# Altium schematic sheet VREF.SchDoc
size A4; ApprovedBy: Mateusz Kowalik; CheckedBy: Mateusz Kowalik; Author: Mateusz Kowalik; CompanyName: InMotion Labs sp. z o.o.; DrawnBy: Mateusz Kowalik; Engineer: Mateusz Kowalik; Organization: InMotion Labs sp. z o.o.; Address1: Rydlówka 5A; Address2: 30-363 Kraków; Address4: Poland; DocumentNumber: 11; Revision: Rev 0; SheetNumber: 11; SheetTotal: 17
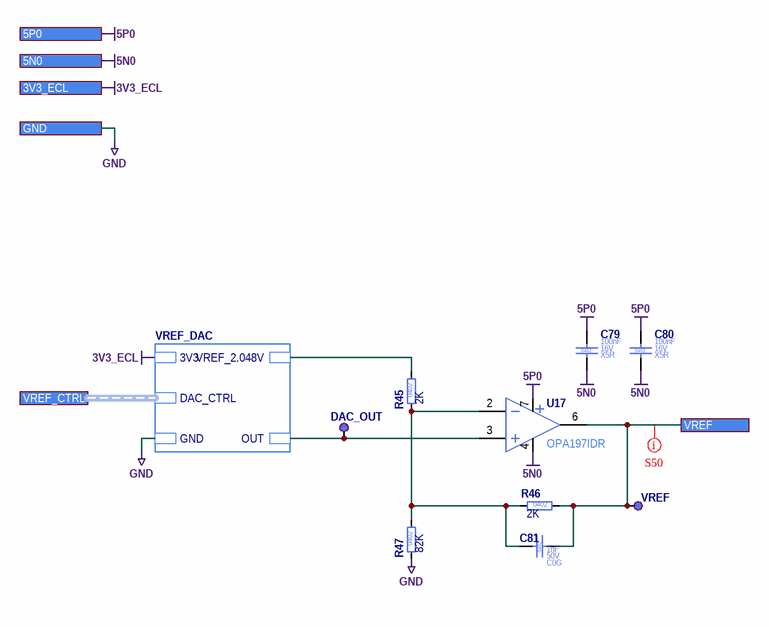
[diagram p0: VREF.SchDoc]

## Parts
C79  Case/Package: 0402  Voltage Rating (DC): 16V  Dielectric: X5R  Capacitance: 100nF  [C_0402_1005]  (hidden comment: C_100NF_16V_X5R_0402_10)
C80  Case/Package: 0402  Voltage Rating (DC): 16V  Dielectric: X5R  Capacitance: 100nF  [C_0402_1005]  (hidden comment: C_100NF_16V_X5R_0402_10)
C81  Case/Package: 0402  Voltage Rating (DC): 50V  Dielectric: C0G  Capacitance: 1nF  [C_0402_1005]  (hidden comment: C_1NF_50V_C0G_0402_5)
DAC_OUT  TP_PAD_1.3MM  [TP_PAD_1.3MM]  (value not drawn)  (no BOM)
R45  Resistance: 2K  Case/Package: 0402  [R_0402_1005]  (hidden comment: R_2K_0402_1)
R46  Resistance: 2K  Case/Package: 0402  [R_0402_1005]  (hidden comment: R_2K_0402_1)
R47  Resistance: 82K  Case/Package: 0402  [R_0402_1005]  (hidden comment: R_82K_0402_1)
U17  OPA197IDR  [SOIC127P600X170-8N]
VREF  TP_PAD_1.3MM  [TP_PAD_1.3MM]  (value not drawn)  (no BOM)

## Sub-sheets
VREF_DAC = DAC_12bit.SchDoc: 3V3, DAC_CTRL (harness DAC), VREF_2.048V, OUT, GND

## Ports
3V3_ECL, 5N0, 5P0, GND, VREF, VREF_CTRL (harness DAC)

## Nets
3V3_ECL: port 3V3_ECL, sheet VREF_DAC/3V3
5N0: C79.2 C80.2 U17.4(VSS) ; port 5N0
5P0: C79.1 C80.1 U17.7(VDD) ; port 5P0
GND: R47.1 ; port GND, sheet VREF_DAC/GND
VREF: C81.2 R46.2 U17.6(OUTA) VREF.1(TP) ; port VREF
NetC81_1: C81.1 R45.1 R46.1 R47.2 U17.2(INA-)
NetDAC_OUT_1: DAC_OUT.1(TP) U17.3(INA+) ; sheet VREF_DAC/OUT
NetR45_2: R45.2 ; sheet VREF_DAC/VREF_2.048V

Not connected (* = marked no-connect by the designer): U17 1(NC) 5(NC) 8(NC)

## Buses and harness runs
harness port VREF_CTRL = sheet VREF_DAC/DAC_CTRL

## Layout directives
net class S50: VREF

## Notes on the sheet
- Title
- Size:
- Date:
- A4

## Library data of the parts
C79 C80 = C_100NF_16V_X5R_0402_10: Ceramic Capacitor; Manufacturer Part Number: EMK105BJ104KV-F; Manufacturer: Taiyo Yuden; Value: 100nF; Tolerance: 10%; Part Number: C_100NF_16V_X5R_0402_10; Mount: Surface Mount; Height: 500um; HelpURL: http://datasheet.octopart.com/EMK105BJ104KV-F-Taiyo-Yuden-datasheet-8857305.pdf; RoHS: Compliant; Max Operating Temperature: 125°C; Status: MK; Supplier 1: Mouser; Supplier Part Number 1: 963-EMK105BJ104KV-F; Manufacturer 2: Samsung Electro-Mechanics; Manufacturer Part Number 2: CL05B104KO5NNNC; Supplier 2: LCSC; Supplier Part Number 2: C1525
C81 = C_1NF_50V_C0G_0402_5: Ceramic Capacitor; Manufacturer Part Number: UMK105CG102JV-F; Manufacturer: Taiyo Yuden; Value: 1nF; Tolerance: 5%; Part Number: C_1NF_50V_C0G_0402_5; Mount: Surface Mount; Height: 500um; HelpURL: https://pl.mouser.com/datasheet/2/396/mlcc02_e-1307760.pdf; RoHS: Compliant; Max Operating Temperature: 125°C; Status: AK; Supplier 1: Mouser; Supplier Part Number 1: 963-JMK212ABJ106KG-T; Manufacturer 2: Guangdong Fenghua Advanced Tech; Manufacturer Part Number 2: 0402B102K500NT; Supplier 2: LCSC; Supplier Part Number 2: C1523
DAC_OUT VREF = TP_PAD_1.3MM: Testpoint SMD 1.3mm; Part Number: TP_PAD_1.3MM; Case/Package: SMD; Length: 0mm
R45 R46 = R_2K_0402_1: Thick Film Resistor; Manufacturer: Yageo; Manufacturer Part Number: RC0402FR-072KL; Value: 2K; Tolerance: 1%; Voltage Rating (DC): 50V; Power Rating: 63mW; Stats: MK; Part Number: R_2K_0402_1; Mount: Surface Mount; Height: 350um; HelpURL: https://pl.mouser.com/datasheet/2/447/PYu-RC_Group_51_RoHS_L_10-1527934.pdf; RoHS: Compliant; Max Operating Temperature: 155°C; Supplier 1: Mouser; Supplier Part Number 1: 603-RC0402FR-072KL; Manufacturer 2: Uniroyal Elec; Manufacturer Part Number 2: 0402WGJ0202TCE; Supplier 2: LCSC; Supplier Part Number 2: C25552
R47 = R_82K_0402_1: Thisk Film Resistor; Manufacturer: Yageo; Manufacturer Part Number: RC0402FR-0782KL; Value: 82K; Tolerance: 1%; Voltage Rating (DC): 50V; Power Rating: 63mW; Stats: MK; Part Number: R_82K_0402_1; Mount: Surface Mount; Height: 350um; HelpURL: http://datasheet.octopart.com/RC0402FR-07931RL-Yageo-datasheet-10408619.pdf; RoHS: Compliant; Max Operating Temperature: 155°C; Supplier 1: Mouser; Supplier Part Number 1: 603-RC0402FR-0782KL; Manufacturer 2: Uniroyal Elec; Manufacturer Part Number 2: 0402WGF8202TCE; Supplier 2: LCSC; Supplier Part Number 2: C4142
U17 = OPA197IDR: Single Precision Rail-to-Rail Input Outpu Low Offset Voltage Op Amp; Manufacturer: Texas Instruments; Input Offset Voltage (Vos): 100uV; Max Supply Voltage: 36V; Min Supply Voltage: 4.5V; Number of Amplifiers: 1; Part Number: OPA197IDR; Manufacturer Part Number: OPA197IDR; Case/Package: SOIC8; Mount: Surface Mount; Height: 1.75mm; HelpURL: https://www.ti.com/lit/ds/symlink/opa197.pdf?ts=1615653815139; Marking: OPA197; Max Operating Temperature: 125°C; RoHS: Compliant; Supplier 1: Mouser; Supplier Part Number 1: 595-OPA197IDR